# EAGLE design HW2 (EAGLE 8.7.1)
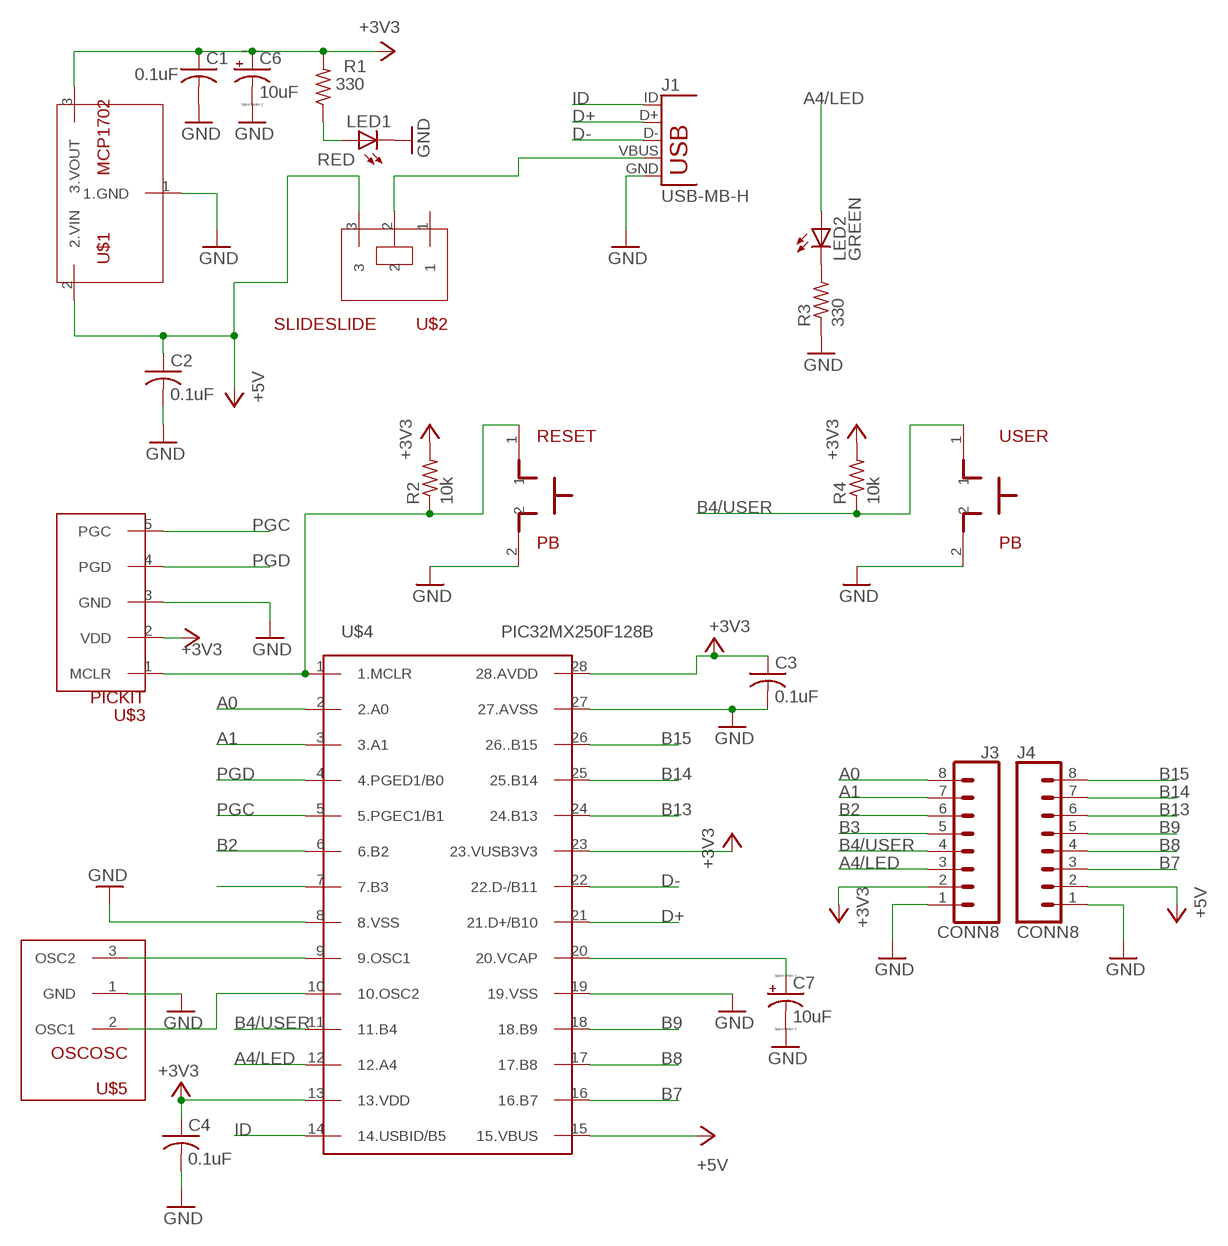
[diagram p0: schematic, sheet 1]

## Parts
C1  0.1uF  C-US025-025X050  [C025-025X050]
C2  0.1uF  C-US025-025X050  [C025-025X050]
C3  0.1uF  C-US025-025X050  [C025-025X050]
C4  0.1uF  C-US025-025X050  [C025-025X050]
C6  10uF  CPOL-USB45181B  [B45181B]
C7  10uF  CPOL-USB45181B  [B45181B]
J1  USB-MB-H  [USB-MB-H]
J3  CONN8  [1X08]
J4  CONN8  [1X08]
LED1  RED  LED3MM  [LED3MM]
LED2  GREEN  LED3MM  [LED3MM]
R1  330  R-US_0207/10  [0207/10]
R2  10k  R-US_0207/10  [0207/10]
R3  330  R-US_0207/10  [0207/10]
R4  10k  R-US_0207/10  [0207/10]
RESET  PB  [PB]
U$1  MCP1702  [TO92]
U$2  SLIDESLIDE  [SLIDE]
U$3  PICKIT  [1X05]
U$4  PIC32MX250F128B  [DIL28-3]
U$5  OSCOSC  [OSC]
USER  PB  [PB]

## Nets
+3V3: C1.1 C3.1 C4.1 C6.+ J3.2 R1.2 R2.2 R4.2 U$1.3(3.VOUT) U$3.2(VDD) U$4.13(13.VDD) U$4.23(23.VUSB3V3) U$4.28(28.AVDD)
+5V: C2.1 J4.2 U$1.2(2.VIN) U$2.3 U$4.15(15.VBUS)
A0: J3.8 U$4.2(2.A0)
A1: J3.7 U$4.3(3.A1)
A4/LED: J3.3 LED2.A U$4.12(12.A4)
B2: J3.6 U$4.6(6.B2)
B3: J3.5 U$4.7(7.B3)
B4/USER: J3.4 R4.1 U$4.11(11.B4) USER.1
B7: J4.3 U$4.16(16.B7)
B8: J4.4 U$4.17(17.B8)
B9: J4.5 U$4.18(18.B9)
B13: J4.6 U$4.24(24.B13)
B14: J4.7 U$4.25(25.B14)
B15: J4.8 U$4.26(26..B15)
D+: J1.D+ U$4.21(21.D+/B10)
D-: J1.D- U$4.22(22.D-/B11)
GND: C1.2 C2.2 C3.2 C4.2 C6.- C7.- J1.GND J3.1 J4.1 LED1.K(C) R3.1 RESET.2 U$1.1(1.GND) U$3.3(GND) U$4.8(8.VSS) U$4.19(19.VSS) U$4.27(27.AVSS) U$5.1(GND) USER.2
ID: J1.ID U$4.14(14.USBID/B5)
N$2: LED1.A R1.1
N$3: R2.1 RESET.1 U$3.1(MCLR) U$4.1(1.MCLR)
N$4: LED2.K(C) R3.2
N$5: J1.VBUS U$2.2
N$7: U$4.9(9.OSC1) U$5.3(OSC2)
N$9: U$4.10(10.OSC2) U$5.2(OSC1)
N$13: C7.+ U$4.20(20.VCAP)
PGC: U$3.5(PGC) U$4.5(5.PGEC1/B1)
PGD: U$3.4(PGD) U$4.4(4.PGED1/B0)
Unconnected: U$2.1

## Library data of the parts
C1-C4 = HW2:C-US: CAPACITOR, American symbol
C6 C7 = HW2:CPOL-US: POLARIZED CAPACITOR, American symbol
J1 = HW2:USB: USB Connectors USB-B-PTH is fully proven SKU : PRT-00139/CONN-08278 USB-miniB is fully proven SKU : PRT-00587 USB-A-PCB is untested. USB-A-H is throughly reviewed, but untested. Spark Fun Electronics SKU : PRT-00437 USB-B-SMT is throughly reviewed, but untested. Needs silkscreen touching up. USB-A-S has not been used/tested USB-MB-H has not been used/tested USB-MICROB has been used. CONN-09505
J3 J4 = HW2:CONN8
LED1 LED2 = led:LED: LED OSRAM: - CHIPLED LG R971, LG N971, LY N971, LG Q971, LY Q971, LO R971, LY R971 LH N974, LH R974 LS Q976, LO Q976, LY Q976 LO Q996 - Hyper CHIPLED LW Q18S LB Q993, LB Q99A, LB R99A - SideLED LS A670, LO A670, LY A670, LG A670, LP A670 LB A673, LV A673, LT A673, LW A673 LH A674 LY A675 LS A676, LA A676, LO A676, LY A676, LW A676 LS A679, LY A679, LG A679 - Hyper Micro SIDELED® LS Y876, LA Y876, LO Y876, LY Y876 LT Y87S - SmartLED LW L88C, LW L88S LB L89C, LB L89S, LG L890 LS L89K, LO L89K, LY L89K LS L896, LA L896, LO L896, LY L896 - TOPLED LS T670, LO T670, LY T670, LG T670, LP T670 LSG T670, LSP T670, LSY T670, LOP T670, LYG T670 LG T671, LOG T671, LSG T671 LB T673, LV T673, LT T673, LW T673 LH T674 LS T676, LA T676, LO T676, LY T676, LB T676, LH T676, LSB T676, LW T676 LB T67C, LV T67C, LT T67C, LS T67K, LO T67K, LY T67K, LW E67C LS E67B, LA E67B, LO E67B, LY E67B, LB E67C, LV E67C, LT E67C LW T67C LS T679, LY T679, LG T679 LS T770, LO T770, LY T770, LG T770, LP T770 LB T773, LV T773, LT T773, LW T773 LH T774 LS E675, LA E675, LY E675, LS T675 LS T776, LA T776, LO T776, LY T776, LB T776 LHGB T686 LT T68C, LB T68C - Hyper Mini TOPLED® LB M676 - Mini TOPLED Santana® LG M470 LS M47K, LO M47K, LY M47K Source: http://www.osram.convergy.de LUXEON: - LUMILED® LXK2-PW12-R00, LXK2-PW12-S00, LXK2-PW14-U00, LXK2-PW14-V00 LXK2-PM12-R00, LXK2-PM12-S00, LXK2-PM14-U00 LXK2-PE12-Q00, LXK2-PE12-R00, LXK2-PE12-S00, LXK2-PE14-T00, LXK2-PE14-U00 LXK2-PB12-K00, LXK2-PB12-L00, LXK2-PB12-M00, LXK2-PB14-N00, LXK2-PB14-P00, LXK2-PB14-Q00 LXK2-PR12-L00, LXK2-PR12-M00, LXK2-PR14-Q00, LXK2-PR14-R00 LXK2-PD12-Q00, LXK2-PD12-R00, LXK2-PD12-S00 LXK2-PH12-R00, LXK2-PH12-S00 LXK2-PL12-P00, LXK2-PL12-Q00, LXK2-PL12-R00 Source: www.luxeon.com KINGBRIGHT: KA-3528ASYC Source: www.kingbright.com
R1-R4 = HW2:R-US_: RESISTOR, American symbol
RESET USER = HW2:PB
U$1 = HW2:MCP1702
U$2 = HW2:SLIDE
U$3 = HW2:PICKIT
U$4 = HW2:PIC32MX250F128B
U$5 = HW2:OSC

## Board
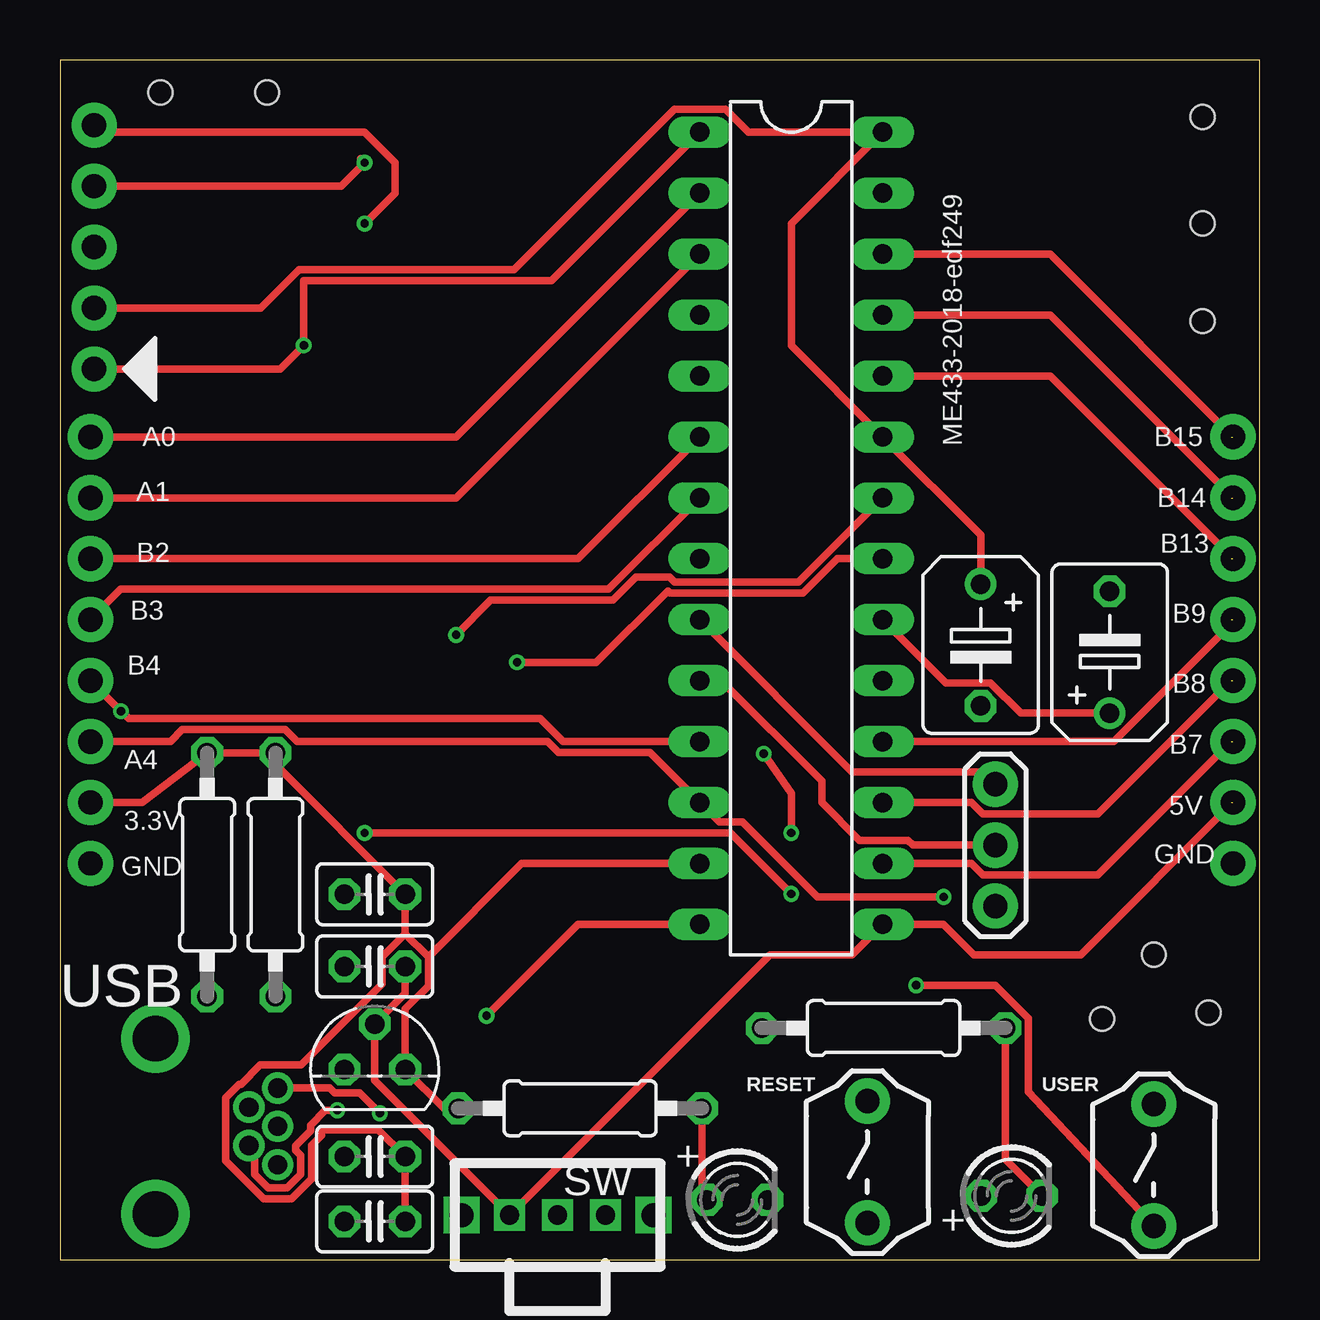
[diagram p1: board, top side]
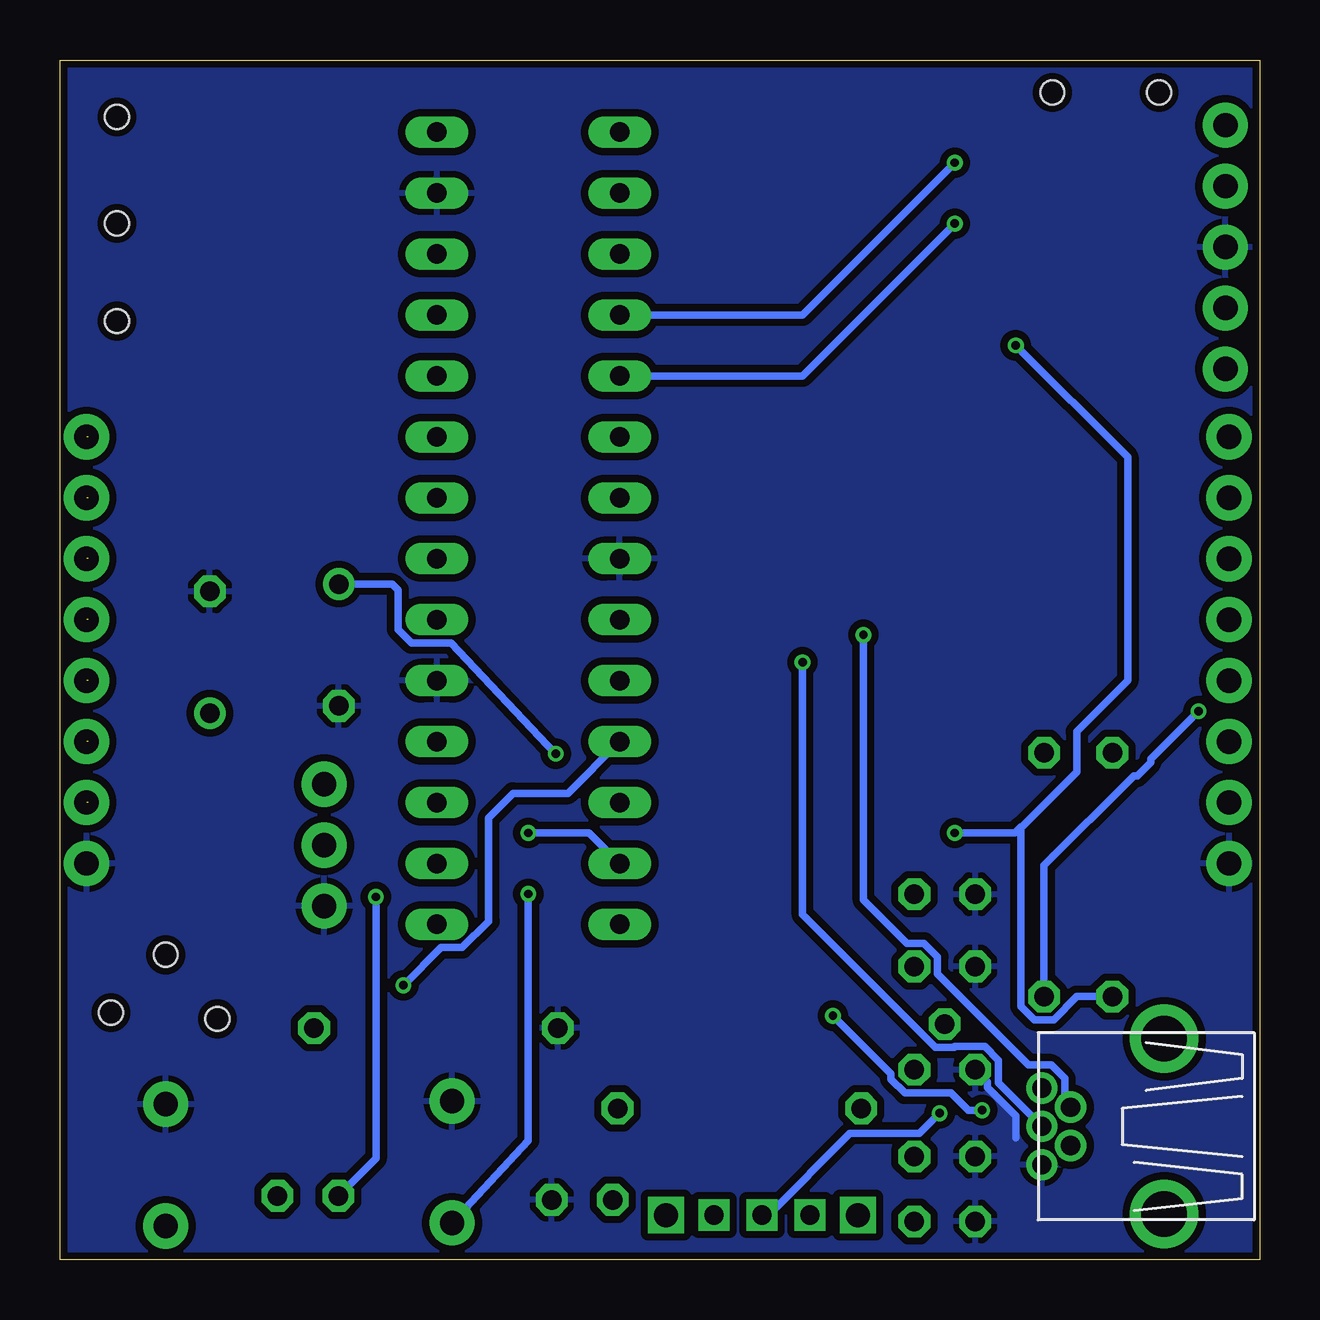
[diagram p2: board, bottom side, seen from below]

Size 50 x 50 mm. Coordinates in mm from the lower left corner, seen from the top.
Outline: 0,0 50,0 50,50 0,50 0,0
Copper layers (1*16): Top 0.035mm / dielectric 1.5mm / Bottom 0.035mm
Design rules "SeeedStudio_2layer_DRU_no_angle_20140221": minimum track width 6mil, minimum drill 12mil, track to track 6mil, track to pad 6mil, pad to pad 6mil, via to via 6mil, smd to smd 0mil, copper to edge 10mil, drill to drill 10mil, minimum pad ring 10mil, minimum via ring 6mil, stop-mask expansion 2mil, vias tented up to drill 100mil, thermal gap 10mil
Holes 1 mm at 47.62,47.62 47.88,10.29 4.19,48.64 43.43,10.03 45.59,12.7 47.62,43.18 47.62,39.12 8.64,48.64

### Footprints (pad centres in the part's own frame; a part is rotated, then mirrored left to right if it is on the bottom)
C025-025X050 = drill 0.813 octagon: 1 -1.27,0; 2 1.27,0
B45181B = drill 0.813: + -2.54,0 | drill 0.813 octagon: - 2.54,0
USB-MB-H = drill 0.8: D+ 5.1,0; D- 3.9,0.8; GND 5.1,-1.6; ID 3.9,-0.8; VBUS 5.1,1.6 | drill 1.9: NC1 0,-3.65; NC2 0,3.65
1X08 = drill 1.016 pad 1.88: 1 0,0; 2 2.54,0; 3 5.08,0; 4 7.62,0; 5 10.16,0; 6 12.7,0; 7 15.24,0; 8 17.78,0
LED3MM = drill 0.813 octagon: A -1.27,0; K 1.27,0
0207/10 = drill 0.813 octagon: 1 -5.08,0; 2 5.08,0
PB = drill 1.016 pad 1.88: 1 -2.54,0; 2 2.54,0
TO92 = drill 0.813 octagon: 1 -1.27,0; 2 0,1.905; 3 1.27,0
SLIDE = drill 0.8 square: 1 -2,0; 2 0,0; 3 2,0 | drill 1 square: P$1 -4,0; P$2 4,0
1X05 = drill 1.016 pad 1.88: 1 0,0; 2 2.54,0; 3 5.08,0; 4 7.62,0; 5 10.16,0
DIL28-3 = drill 0.813 long: 1 -16.51,-3.81; 2 -13.97,-3.81; 3 -11.43,-3.81; 4 -8.89,-3.81; 5 -6.35,-3.81; 6 -3.81,-3.81; 7 -1.27,-3.81; 8 1.27,-3.81; 9 3.81,-3.81; 10 6.35,-3.81; 11 8.89,-3.81; 12 11.43,-3.81; 13 13.97,-3.81; 14 16.51,-3.81; 15 16.51,3.81; 16 13.97,3.81; 17 11.43,3.81; 18 8.89,3.81; 19 6.35,3.81; 20 3.81,3.81; 21 1.27,3.81; 22 -1.27,3.81; 23 -3.81,3.81; 24 -6.35,3.81; 25 -8.89,3.81; 26 -11.43,3.81; 27 -13.97,3.81; 28 -16.51,3.81
OSC = drill 1.016 pad 1.88: 1 -2.54,0; 2 0,0; 3 2.54,0

### Placement (x,y rotation side)
C1  13.12,15.23 180 top
C2  13.12,12.22 180 top
C3  13.12,1.59 180 top
C4  13.12,4.29 180 top
C6  38.38,25.62 270 top
C7  43.75,25.31 90 top
J1  3.98,5.55 0 top
J3  1.27,16.51 90 top
J4  48.9,16.51 90 top
LED1  28.23,2.49 0 top
LED2  39.66,2.65 0 top
R1  21.68,6.3 180 top
R2  6.13,16.04 90 top
R3  34.33,9.65 0 top
R4  8.98,16.04 90 top
RESET  33.66,4.06 90 top
U$1  13.12,7.91 0 top
U$2  20.74,1.85 180 top
U$3  1.42,37.12 90 top
U$4  30.48,30.48 270 top
U$5  38.99,17.27 90 top
USER  45.59,3.94 90 top

### Tracks (layer width: path | path; a pad name or v marks a point on that pad's centre or on a via)
+3V3  (via drill 0.35)
  Top 0.305: R1.2 16,6.3 U$1.3 14.39,10.44 15.35,11.41 15.35,12.62 | C3.1 C4.1 13.27,5.41 10.9,5.41 10.9,5.17 10.49,4.76 10.49,3.36 9.66,2.53 8.49,2.53 6.92,4.11 6.92,6.75 7.48,7.31 7.55,7.31 8.35,8.11 10.05,8.11 13.42,11.49 13.42,12.62 14.39,13.58 | 14.39,13.58 C1.1 8.98,20.64 R4.2 R2.2 3.43,19.05 J3.2 | 14.39,13.58 15.35,12.62 | C6.+ 38.38,30.2 U$4.23 30.48,38.1 30.48,43.18 U$4.28 28.7,46.99 27.73,47.95 25.61,47.95 18.92,41.26 9.97,41.26 8.37,39.66 U$3.2 | 15.35,12.62 19.25,16.51 U$4.13 | v30.48,17.78 30.48,19.43 v29.34,21.08
  Bottom 0.305: U$4.13 27.94,17.78 v30.48,17.78 | C6.+ 36.16,28.16 35.92,27.91 35.92,26.27 35.35,25.7 33.71,25.7 v29.34,21.08
+5V  (1 unrouted)
  Top 0.305: C2.1 14.39,11.09 U$1.2 13.12,7.47 U$2.3 29.59,12.7 33.02,12.7 U$4.15 36.83,13.97 38.1,12.7 42.55,12.7 48.83,18.99 48.83,19.05
A0
  Top 0.305: J3.8 16.51,34.29 U$4.2
A1
  Top 0.305: J3.7 16.51,31.75 U$4.3
A4/LED  (via drill 0.35)
  Top 0.305: J3.3 4.61,21.59 5.1,22.09 9.38,22.09 9.88,21.59 20.32,21.59 20.78,21.13 24.59,21.13 U$4.12 27.48,18.24 28.45,18.24 31.57,15.11 v36.83,15.11
  Bottom 0.305: v36.83,15.11 36.83,4.21 LED2.A
B2
  Top 0.305: J3.6 21.59,29.21 U$4.6
B3
  Top 0.305: J3.5 2.54,27.94 22.86,27.94 U$4.7
B4/USER  (via drill 0.35)
  Top 0.305: U$4.11 20.97,21.59 20.01,22.54 2.86,22.54 v2.54,22.86 J3.4 | USER.1 40.37,7 40.37,10.05 38.99,11.43 v35.69,11.43
  Bottom 0.305: R4.1 8.98,16.42 5.25,20.16 5.1,20.16 4.54,20.72 4.54,20.86 v2.54,22.86 | v35.69,11.43 34.11,13.01 33.23,13.01 32.13,14.1 32.13,18.41 31.11,19.43 28.83,19.43 U$4.11
B7  (1 unrouted)
  Top 0.305: U$4.16 37.99,16.51 38.47,16.03 43.27,16.03 48.83,21.59
B8  (1 unrouted)
  Top 0.305: U$4.17 37.99,19.05 38.47,18.57 43.27,18.57 48.83,24.13
B9  (1 unrouted)
  Top 0.305: 48.83,26.67 48.83,26.48 43.94,21.59 U$4.18
B13  (1 unrouted)
  Top 0.305: U$4.24 41.27,36.83 48.83,29.27 48.83,29.21
B14  (1 unrouted)
  Top 0.305: U$4.25 41.27,39.37 48.83,31.81 48.83,31.75
B15  (1 unrouted)
  Top 0.305: U$4.26 41.27,41.91 48.83,34.35 48.83,34.29
D+  (via drill 0.35)
  Top 0.305: v19.05,24.89 22.35,24.89 25.33,27.87 25.42,27.79 30.97,27.79 32.4,29.21 U$4.21
  Bottom 0.305: J1.D+ 10.88,7.36 10.88,8.31 11.45,8.88 12.69,8.88 12.72,8.85 13.52,8.85 19.05,14.38 v19.05,24.89
D-  (via drill 0.35)
  Top 0.305: v16.51,26.04 17.96,27.48 23.05,27.48 24.02,28.45 25.41,28.45 25.61,28.25 30.79,28.25 U$4.22
  Bottom 0.305: v16.51,26.04 16.51,14.98 14.71,13.18 13.99,13.18 13.42,12.62 13.42,11.9 9.63,8.11 8.68,8.11 8.12,7.55 8.12,6.59 J1.D-
GND
  Bottom 0.305: U$1.1 11.34,7.4 11.34,7.17 10.16,5.99 10.16,5.08
  pour Bottom (isolate 0.305): 0,50.8 50.8,50.8 50.8,-1.02 50.67,-1.14 -0.64,-1.14 -1.02,-0.76 -1.02,49.78
ID  (via drill 0.35)
  Top 0.305: v17.78,10.16 21.59,13.97 U$4.14 | v11.56,6.22 11.06,6.22 10.44,5.6 10.44,5.36 9.83,4.75 9.83,4.55 10.03,4.35 10.03,3.55 9.47,2.99 8.68,2.99 8.12,3.55 8.12,4.51 J1.ID
  Bottom 0.305: v17.78,10.16 15.35,7.73 15.35,7.51 14.79,6.95 12.86,6.95 12.13,6.22 v11.56,6.22
N$2
  Top 0.305: R1.1 26.76,2.69 LED1.A
N$3  (via drill 0.35)
  Top 0.305: U$4.1 20.48,40.8 10.16,40.8 v10.16,38.1 9.18,37.12 U$3.1 | v12.7,17.78 27.94,17.78 v30.48,15.24
  Bottom 0.305: v10.16,38.1 5.5,33.44 5.5,24.13 7.62,22.01 7.62,20.32 9.9,18.04 9.95,18.04 | 9.95,18.04 9.95,10.56 9.38,9.99 8.58,9.99 7.62,10.96 R2.1 | 9.95,18.04 10.21,17.78 v12.7,17.78 | RESET.1 30.48,4.95 v30.48,15.24
N$4
  Top 0.305: R3.2 39.41,4.18 LED2.K
N$5  (via drill 0.35)
  Top 0.305: v13.34,6.1 12.48,6.95 11.45,6.95 11.25,7.15 J1.VBUS
  Bottom 0.305: v13.34,6.1 14.17,5.26 17.07,5.26 20.48,1.85 U$2.2
N$7
  Top 0.305: U$5.3 38.48,20.32 33.02,20.32 U$4.9
N$9
  Top 0.305: U$5.2 35.55,17.27 35.35,17.48 33.33,17.48 31.75,19.05 31.75,19.94 27.56,24.13 U$4.10
N$13
  Top 0.305: C7.+ 40.05,22.77 38.78,24.04 36.92,24.04 U$4.20
PGC  (via drill 0.35)
  Top 0.305: U$3.5 1.72,46.99 12.7,46.99 13.97,45.72 13.97,44.45 v12.7,43.18
  Bottom 0.305: v12.7,43.18 19.05,36.83 U$4.5
PGD  (via drill 0.35)
  Top 0.305: 12.54,45.88 v12.7,45.72 11.72,44.74 U$3.4
  Bottom 0.305: v12.7,45.72 19.05,39.37 U$4.4

### Text on the board
tPlace: A0 | ME433-2018-edf249 | B15 | A1 | B14 | B2 | B13 | B3 | B9 | B4 | B8 | B7 | A4 | 5V | 3.3V | GND | GND
tNames: USB | + | SW | +
200bmp: FOX